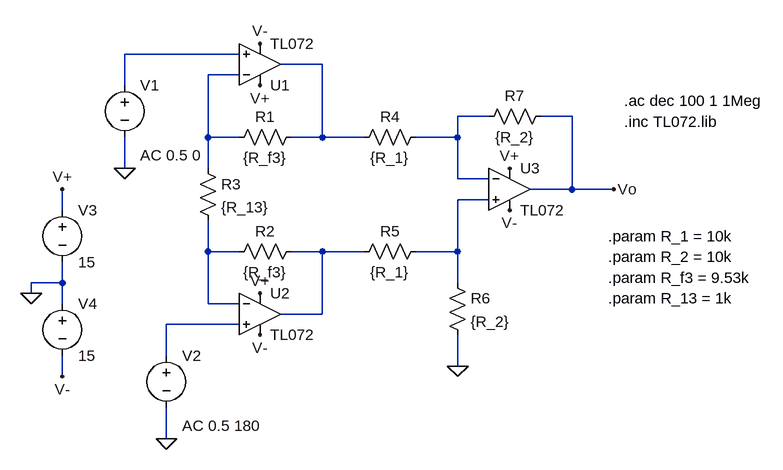
[diagram p0: schematic Amplificador_De_Instrumentacion.asc]
Amplificador_De_Instrumentacion.asc, the LTspice schematic file:
Version 4.1
SHEET 1 880 696
WIRE 64 64 -112 64
WIRE 192 80 128 80
WIRE 64 96 16 96
WIRE -112 112 -112 64
WIRE 448 160 400 160
WIRE 576 160 528 160
WIRE 16 192 16 96
WIRE 64 192 16 192
WIRE 192 192 192 80
WIRE 192 192 144 192
WIRE 256 192 192 192
WIRE 400 192 400 160
WIRE 400 192 336 192
WIRE -112 240 -112 192
WIRE 16 240 16 192
WIRE 400 256 400 192
WIRE 448 256 400 256
WIRE 576 272 576 160
WIRE 576 272 512 272
WIRE 640 272 576 272
WIRE 448 288 400 288
WIRE -208 304 -208 272
WIRE 16 368 16 320
WIRE 64 368 16 368
WIRE 192 368 144 368
WIRE 256 368 192 368
WIRE 400 368 400 288
WIRE 400 368 336 368
WIRE -208 416 -208 384
WIRE -208 416 -256 416
WIRE 400 416 400 368
WIRE -256 432 -256 416
WIRE -208 448 -208 416
WIRE 16 448 16 368
WIRE 64 448 16 448
WIRE 192 464 192 368
WIRE 192 464 128 464
WIRE 64 480 -48 480
WIRE -48 528 -48 480
WIRE 400 544 400 496
WIRE -208 560 -208 528
WIRE -48 656 -48 608
FLAG 640 272 Vo
FLAG 400 544 0
FLAG -112 240 0
FLAG -48 656 0
FLAG -256 432 0
FLAG -208 272 V+
FLAG -208 560 V-
FLAG 96 112 V+
FLAG 96 432 V+
FLAG 480 240 V+
FLAG 96 496 V-
FLAG 480 304 V-
FLAG 96 48 V-
SYMBOL res 160 176 R90
WINDOW 0 0 56 VBottom 2
WINDOW 3 32 56 VTop 2
SYMATTR InstName R1
SYMATTR Value {R_f3}
SYMBOL res 160 352 R90
WINDOW 0 0 56 VBottom 2
WINDOW 3 32 56 VTop 2
SYMATTR InstName R2
SYMATTR Value {R_f3}
SYMBOL res 0 224 R0
SYMATTR InstName R3
SYMATTR Value {R_13}
SYMBOL res 352 176 R90
WINDOW 0 0 56 VBottom 2
WINDOW 3 32 56 VTop 2
SYMATTR InstName R4
SYMATTR Value {R_1}
SYMBOL res 352 352 R90
WINDOW 0 0 56 VBottom 2
WINDOW 3 32 56 VTop 2
SYMATTR InstName R5
SYMATTR Value {R_1}
SYMBOL res 384 400 R0
SYMATTR InstName R6
SYMATTR Value {R_2}
SYMBOL res 544 144 R90
WINDOW 0 0 56 VBottom 2
WINDOW 3 32 56 VTop 2
SYMATTR InstName R7
SYMATTR Value {R_2}
SYMBOL voltage -112 96 R0
WINDOW 123 24 124 Left 2
WINDOW 39 0 0 Left 0
SYMATTR InstName V1
SYMATTR Value ""
SYMATTR Value2 AC 0.5 0
SYMBOL voltage -48 512 R0
WINDOW 123 24 124 Left 2
WINDOW 39 0 0 Left 0
SYMATTR InstName V2
SYMATTR Value ""
SYMATTR Value2 AC 0.5 180
SYMBOL OpAmps\\opamp2 96 144 M180
SYMATTR InstName U1
SYMATTR Value TL072
SYMBOL OpAmps\\opamp2 96 400 R0
SYMATTR InstName U2
SYMATTR Value TL072
SYMBOL OpAmps\\opamp2 480 208 R0
SYMATTR InstName U3
SYMATTR Value TL072
SYMBOL voltage -208 288 R0
SYMATTR InstName V3
SYMATTR Value 15
SYMBOL voltage -208 432 R0
SYMATTR InstName V4
SYMATTR Value 15
TEXT 656 136 Left 2 !.ac dec 100 1 1Meg
TEXT 632 344 Left 2 !.param R_1 = 10k
TEXT 632 376 Left 2 !.param R_2 = 10k
TEXT 632 408 Left 2 !.param R_f3 = 9.53k
TEXT 632 440 Left 2 !.param R_13 = 1k
TEXT 656 168 Left 2 !.inc TL072.lib

The netlist it stands for:
* Amplificador_De_Instrumentacion.asc
R1 N002 N003 {R_f3}
R2 N007 N006 {R_f3}
R3 N003 N006 {R_13}
R4 N004 N002 {R_1}
R5 N005 N007 {R_1}
R6 N005 0 {R_2}
R7 Vo N004 {R_2}
V1 N001 0 AC 0.5 0
V2 N008 0 AC 0.5 180
X§U1 N001 N003 V+ V- N002 TL072  ; pins In+ In- V+ V- OUT
X§U2 N008 N006 V+ V- N007 TL072  ; pins In+ In- V+ V- OUT
X§U3 N005 N004 V+ V- Vo TL072  ; pins In+ In- V+ V- OUT
V3 V+ 0 15
V4 0 V- 15
.ac dec 100 1 1Meg
.param R_1 = 10k
.param R_2 = 10k
.param R_f3 = 9.53k
.param R_13 = 1k
.inc TL072.lib
.backanno
.end